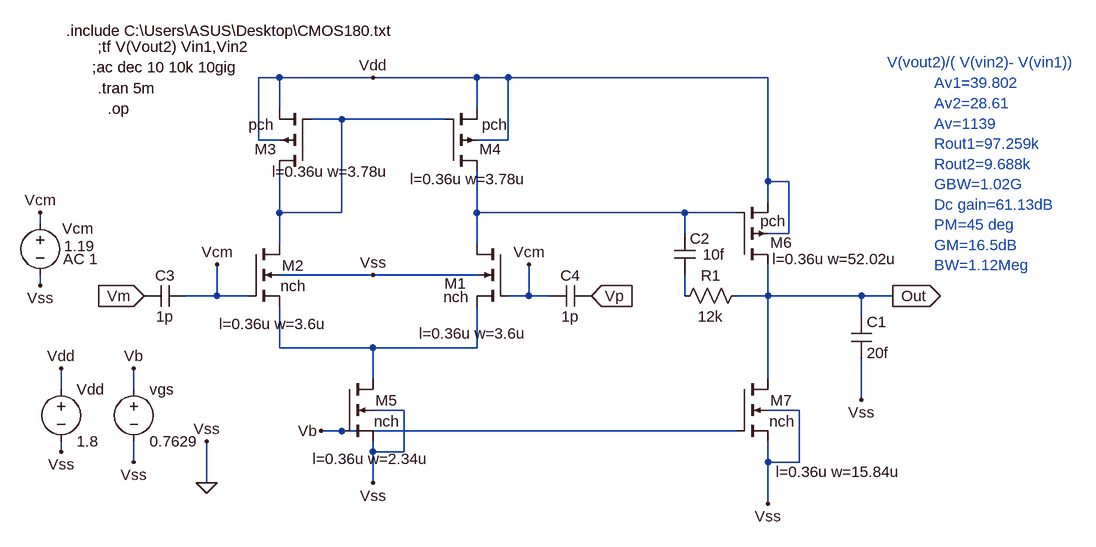
[diagram p0: schematic final design two stage opamp.asc]
final design two stage opamp.asc, the LTspice schematic file:
Version 4
SHEET 1 1604 680
WIRE 368 -160 336 -160
WIRE 512 -160 368 -160
WIRE 672 -160 512 -160
WIRE 720 -160 672 -160
WIRE 1120 -160 720 -160
WIRE 368 -112 368 -160
WIRE 672 -112 672 -160
WIRE 464 -96 416 -96
WIRE 624 -96 464 -96
WIRE 336 -64 336 -160
WIRE 368 -64 336 -64
WIRE 720 -64 720 -160
WIRE 720 -64 672 -64
WIRE 1120 0 1120 -160
WIRE 1152 0 1120 0
WIRE 1120 32 1120 0
WIRE 368 48 368 -16
WIRE 464 48 464 -96
WIRE 464 48 368 48
WIRE 672 48 672 -16
WIRE 992 48 672 48
WIRE 1072 48 992 48
WIRE 0 64 0 48
WIRE 992 80 992 48
WIRE 1152 80 1152 0
WIRE 1152 80 1120 80
WIRE 368 96 368 48
WIRE 672 96 672 48
WIRE 512 144 368 144
WIRE 672 144 512 144
WIRE 0 160 0 144
WIRE 272 176 272 128
WIRE 272 176 224 176
WIRE 320 176 272 176
WIRE 752 176 752 128
WIRE 752 176 720 176
WIRE 784 176 752 176
WIRE 992 176 992 144
WIRE 1120 176 1120 128
WIRE 1120 176 1072 176
WIRE 1264 176 1120 176
WIRE 1312 176 1264 176
WIRE 1264 208 1264 176
WIRE 368 256 368 192
WIRE 512 256 368 256
WIRE 672 256 672 192
WIRE 672 256 512 256
WIRE 512 304 512 256
WIRE 1120 304 1120 176
WIRE 32 320 32 288
WIRE 144 320 144 288
WIRE 1264 336 1264 272
WIRE 560 352 512 352
WIRE 1168 352 1120 352
WIRE 464 384 432 384
WIRE 1072 384 464 384
WIRE 32 416 32 400
WIRE 512 416 512 400
WIRE 560 416 560 352
WIRE 560 416 512 416
WIRE 144 432 144 400
WIRE 1120 432 1120 400
WIRE 1168 432 1168 352
WIRE 1168 432 1120 432
WIRE 256 464 256 400
WIRE 512 464 512 416
WIRE 1120 496 1120 432
FLAG 256 464 0
FLAG 256 400 Vss
FLAG 32 416 Vss
FLAG 0 160 Vss
FLAG 32 288 Vdd
FLAG 160 176 Vm
IOPIN 160 176 In
FLAG 512 -160 Vdd
FLAG 512 144 Vss
FLAG 144 288 Vb
FLAG 144 432 Vss
FLAG 432 384 Vb
FLAG 512 464 Vss
FLAG 1312 176 Out
IOPIN 1312 176 Out
FLAG 1120 496 Vss
FLAG 1264 336 Vss
FLAG 848 176 Vp
IOPIN 848 176 In
FLAG 272 128 Vcm
FLAG 752 128 Vcm
FLAG 0 48 Vcm
SYMBOL nmos4 720 96 M0
WINDOW 0 64 61 Left 2
WINDOW 3 60 82 Left 2
WINDOW 123 -29 138 Left 2
SYMATTR InstName M1
SYMATTR Value nch
SYMATTR Value2 l=0.36u w=3.6u
SYMBOL voltage 32 304 R0
WINDOW 123 0 0 Left 0
WINDOW 39 0 0 Left 0
SYMATTR InstName Vdd
SYMATTR Value 1.8
SYMBOL voltage 0 48 R0
WINDOW 3 37 51 Left 2
WINDOW 123 35 71 Left 2
WINDOW 39 0 0 Left 0
WINDOW 0 34 24 Left 2
SYMATTR Value 1.19
SYMATTR Value2 AC 1
SYMATTR InstName Vcm
SYMBOL pmos4 624 -16 M180
WINDOW 123 -55 -12 Left 2
WINDOW 0 52 34 Left 2
SYMATTR Value2 l=0.36u w=3.78u
SYMATTR InstName M4
SYMATTR Value pch
SYMBOL nmos4 320 96 R0
WINDOW 0 52 33 Left 2
WINDOW 3 50 65 Left 2
WINDOW 123 -45 123 Left 2
SYMATTR InstName M2
SYMATTR Value nch
SYMATTR Value2 l=0.36u w=3.6u
SYMBOL voltage 144 304 R0
WINDOW 123 0 0 Left 0
WINDOW 39 0 0 Left 0
SYMATTR InstName vgs
SYMATTR Value 0.7629
SYMBOL pmos4 416 -16 R180
WINDOW 123 -120 -1 Left 2
WINDOW 0 52 34 Left 2
SYMATTR Value2 l=0.36u w=3.78u
SYMATTR InstName M3
SYMATTR Value pch
SYMBOL nmos4 464 304 R0
WINDOW 0 52 33 Left 2
WINDOW 3 50 65 Left 2
WINDOW 123 -45 123 Left 2
SYMATTR InstName M5
SYMATTR Value nch
SYMATTR Value2 l=0.36u w=2.34u
SYMBOL pmos4 1072 128 M180
WINDOW 123 55 9 Left 2
WINDOW 0 52 34 Left 2
WINDOW 3 36 67 Left 2
SYMATTR Value2 l=0.36u w=52.02u
SYMATTR InstName M6
SYMATTR Value pch
SYMBOL nmos4 1072 304 R0
WINDOW 0 52 33 Left 2
WINDOW 3 50 65 Left 2
WINDOW 123 60 143 Left 2
SYMATTR InstName M7
SYMATTR Value nch
SYMATTR Value2 l=0.36u w=15.84u
SYMBOL cap 1248 208 R0
SYMATTR InstName C1
SYMATTR Value 20f
SYMBOL res 1088 160 R90
WINDOW 0 0 56 VBottom 2
WINDOW 3 32 56 VTop 2
SYMATTR InstName R1
SYMATTR Value 12k
SYMBOL cap 976 80 R0
WINDOW 3 44 32 Left 2
SYMATTR Value 10f
SYMATTR InstName C2
SYMBOL cap 224 160 R90
WINDOW 0 0 32 VBottom 2
WINDOW 3 32 32 VTop 2
SYMATTR InstName C3
SYMATTR Value 1p
SYMBOL cap 848 160 R90
WINDOW 0 0 32 VBottom 2
WINDOW 3 32 32 VTop 2
SYMATTR InstName C4
SYMATTR Value 1p
TEXT 40 -232 Left 2 !.include C:\\Users\\ASUS\\Desktop\\CMOS180.txt
TEXT 104 -112 Left 2 !.op
TEXT 88 -208 Left 2 !;tf V(Vout2) Vin1,Vin2
TEXT 80 -176 Left 2 !;ac dec 10 10k 10gig
TEXT 88 -144 Left 2 !.tran 5m
TEXT 1304 -184 Left 2 ;V(vout2)/( V(vin2)- V(vin1))
TEXT 1376 -152 Left 2 ;Av1=39.802\nAv2=28.61\nAv=1139\nRout1=97.259k\nRout2=9.688k\nGBW=1.02G\nDc gain=61.13dB\nPM=45 deg\nGM=16.5dB\nBW=1.12Meg

The netlist it stands for:
* final design two stage opamp.asc
M1 N002 Vcm N004 0 nch l=0.36u w=3.6u
Vdd Vdd 0 1.8
Vcm Vcm 0 1.19 AC 1
M4 N002 N001 Vdd Vdd pch l=0.36u w=3.78u
M2 N001 Vcm N004 0 nch l=0.36u w=3.6u
vgs Vb 0 0.7629
M3 N001 N001 Vdd Vdd pch l=0.36u w=3.78u
M5 N004 Vb 0 0 nch l=0.36u w=2.34u
M6 Out N002 Vdd Vdd pch l=0.36u w=52.02u
M7 Out Vb 0 0 nch l=0.36u w=15.84u
C1 Out 0 20f
R1 Out N003 12k
C2 N002 N003 10f
C3 Vcm Vm 1p
C4 Vp Vcm 1p
.model NMOS NMOS
.model PMOS PMOS
.lib standard.mos
.include C:\Users\ASUS\Desktop\CMOS180.txt
.op
;tf V(Vout2) Vin1,Vin2
;ac dec 10 10k 10gig
.tran 5m
* V(vout2)/( V(vin2)- V(vin1))
* Av1=39.802
* Av2=28.61
* Av=1139
* Rout1=97.259k
* Rout2=9.688k
* GBW=1.02G
* Dc gain=61.13dB
* PM=45 deg
* GM=16.5dB
* BW=1.12Meg
.backanno
.end